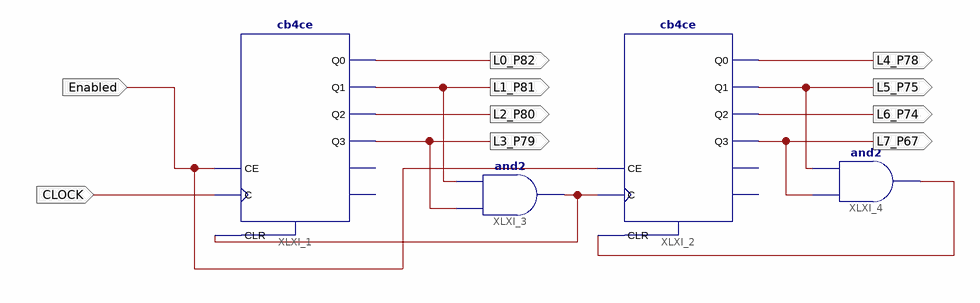
[diagram p0: schematic sheet 1]
// Xilinx ISE schematic Counter.sch (spartan6) as structural Verilog: 4 symbols, 10 ports
module Counter (
  input  Enabled,
  input  CLOCK,
  output L0_P82,
  output L1_P81,
  output L2_P80,
  output L3_P79,
  output L4_P78,
  output L5_P75,
  output L6_P74,
  output L7_P67
);

  wire XLXN_9, XLXN_16;

  cb4ce XLXI_1 (
    .C(CLOCK), .CE(Enabled), .CLR(XLXN_9), .Q0(L0_P82), .Q1(L1_P81), .Q2(L2_P80), .Q3(L3_P79));  // open: CEO, TC
  cb4ce XLXI_2 (
    .C(XLXN_9), .CE(Enabled), .CLR(XLXN_16), .Q0(L4_P78), .Q1(L5_P75), .Q2(L6_P74), .Q3(L7_P67));  // open: CEO, TC
  and XLXI_3 (XLXN_9, L3_P79, L1_P81);
  and XLXI_4 (XLXN_16, L7_P67, L5_P75);

  // Notes on the sheet:
  //   CLOCK_DEDICATED_ROUTE on signal CLOCK = TRUE
endmodule
